# Altium schematic sheet RT-ValveX4+AirPump.SchDoc
size A4
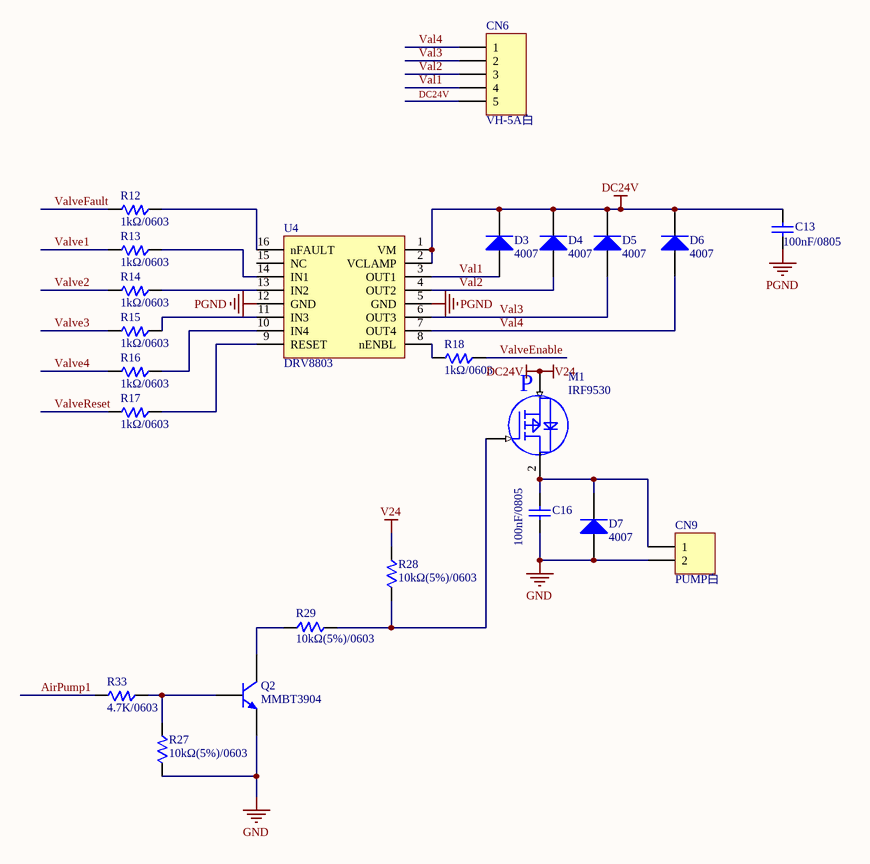
[diagram p0: RT-ValveX4+AirPump.SchDoc]

## Parts
C13  100nF/0805  [0805C]
C16  100nF/0805  [0805C]
CN6  VH-5A白  [CON-VH-5P]
CN9  PUMP白  [CON-VH-2P]
D3  4007  [DO-214AC]
D4  4007  [DO-214AC]
D5  4007  [DO-214AC]
D6  4007  [DO-214AC]
D7  4007  [DO-214AC]
M1  IRF9530  [TO-220AB]
Q2  MMBT3904  [SOT-23-N]
R12  1kΩ/0603  [0603]
R13  1kΩ/0603  [0603]
R14  1kΩ/0603  [0603]
R15  1kΩ/0603  [0603]
R16  1kΩ/0603  [0603]
R17  1kΩ/0603  [0603]
R18  1kΩ/0603  [0603]
R27  10kΩ(5%)/0603  [0603]
R28  10kΩ(5%)/0603  [0603]
R29  10kΩ(5%)/0603  [0603]
R33  4.7K/0603  [0603]
U4  DRV8803  [PWP16]

## Nets
DC24V: C13.2 CN6.5 D3.2(K) D4.2(K) D5.2(K) D6.2(K) M1.3(D) R28.2 U4.1(VM) U4.2(VCLAMP)  [also labelled V24]
GND: C16.1 CN9.2 D7.1(A) Q2.E R27.1
PGND: C13.1 U4.5(GND) U4.12(GND)
AirPump1: R33.1
Val1: CN6.4 D3.1(A) U4.3(OUT1)
Val2: CN6.3 D4.1(A) U4.4(OUT2)
Val3: CN6.2 D5.1(A) U4.6(OUT3)
Val4: CN6.1 D6.1(A) U4.7(OUT4)
Valve1: R13.1
Valve2: R14.1
Valve3: R15.1
Valve4: R16.1
ValveEnable: R18.2
ValveFault: R12.1
ValveReset: R17.1
NetC16_2: C16.2 CN9.1 D7.2(K) M1.2(S)
NetM1_1: M1.1(G) R28.1 R29.1
NetQ2_B: Q2.B R27.2 R33.2
NetQ2_C: Q2.C R29.2
NetR12_2: R12.2 U4.16(nFAULT)
NetR13_2: R13.2 U4.14(IN1)
NetR14_2: R14.2 U4.13(IN2)
NetR15_2: R15.2 U4.11(IN3)
NetR16_2: R16.2 U4.10(IN4)
NetR17_2: R17.2 U4.9(RESET)
NetR18_1: R18.1 U4.8(nENBL)

Not connected (* = marked no-connect by the designer): U4 15(NC)

## Notes on the sheet
- 上海荣泰健康科技股份有限公司
- 设计
- 评审
- 审核
- 版本
- 日期
- (in symbol MP-IRF9530/环保) P

## Library data of the parts
C13 C16 = C0805/104M: 物料名称: 贴片电容104M/50V/0805封装/20%/X7R/环保; 物料编号: 1.01.25.003; 领料单位: 电子车间; 单位: 个; 仓库/库位: 内5X
CN6 = CON-VH-5A(白色): 物料名称: 大直脚VH-5A(白色)/环保; 物料编号: 1.01.57.524; 领料单位: 电子车间; 单位: 个; 仓库/库位: 内5X
CN9 = CON-VH-2A(白色): 物料名称: 大直脚VH-2A(白色)/环保; 物料编号: 1.01.57.500; 领料单位: 电子车间; 单位: 个; 仓库/库位: 内5X
D3-D7 = D4007/M7: 物料名称: 贴片二极管M7A/A-SMA封装/环保; 物料编号: 1.01.33.005; 领料单位: 电子车间; 单位: 个; 仓库/库位: 内5X
M1 = MP-IRF9530/环保: 物料名称: 场效应管(MOS管)IRF9530/环保; 物料编号: 1.01.40.003; 领料单位: 电子车间; 单位: 个; 仓库/库位: 内5X
Q2 = Q-MMBT3904/1AM-N: 物料名称: 贴片三极管1AM/MMBT3904/sot-23封装环保; 物料编号: 1.01.33.013; 领料单位: 电子车间; 单位: 个; 仓库/库位: 内5X
R12-R18 = R0603/1kΩ: 物料编号: 1.01.15.111; 物料名称: 贴片电阻1K/(5%)/0603封装/环保; 领料单位: 电子车间; 单位: 个; 仓库/库位: 内5X
R27-R29 = R0603/10kΩ/(5%): 物料编号: 1.01.15.105; 物料名称: 贴片电阻10kΩ/(5%)0603封装/环保; 领料单位: 个; 仓库/库位: 内5X
R33 = R0603/4.7K/(5%): 物料编号: 1.01.15.115; 物料名称: 贴片电阻4.7K/(5%)/0603封装/环保; 领料单位: 电子车间; 单位: 个; 仓库/库位: 内5X
U4 = IC-DRV8803: 物料名称: PWM输入4通道低侧驱动器DRV8803; 物料编号: 1.01.45.544; 领料单位: 电子车间; 单位: 个; 仓库/库位: 内5X